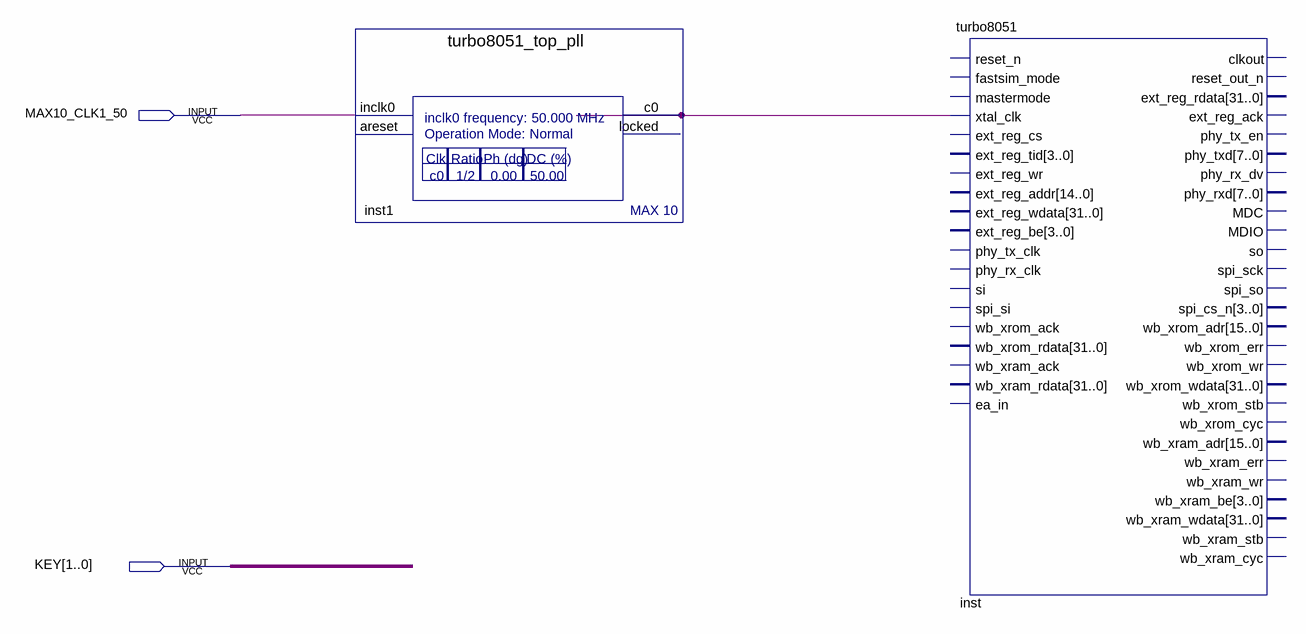
[diagram p0: schematic sheet]
// Quartus schematic turbo8051_test_top.bdf as structural Verilog: 2 symbols, 2 pins
module turbo8051_test_top (
  input  MAX10_CLK1_50,
  input  [1:0] KEY
);

  wire inst1_c0;

  turbo8051_top_pll inst1 (.inclk0(MAX10_CLK1_50), .c0(inst1_c0));  // open: areset, locked
  turbo8051 inst (.xtal_clk(inst1_c0));  // open: reset_n, fastsim_mode, mastermode, ext_reg_cs, ext_reg_tid, ext_reg_wr, ext_reg_addr, ext_reg_wdata, ext_reg_be, phy_tx_clk, phy_rx_clk, si, spi_si, wb_xrom_ack, wb_xrom_rdata, wb_xram_ack, wb_xram_rdata, ea_in, clkout, reset_out_n, ext_reg_rdata, ext_reg_ack, phy_tx_en, phy_txd, phy_rx_dv, phy_rxd, MDC, so, spi_sck, spi_so, spi_cs_n, wb_xrom_adr, wb_xrom_err, wb_xrom_wr, wb_xrom_wdata, wb_xrom_stb, wb_xrom_cyc, wb_xram_adr, wb_xram_err, wb_xram_wr, wb_xram_be, wb_xram_wdata, wb_xram_stb, wb_xram_cyc, MDIO
endmodule
